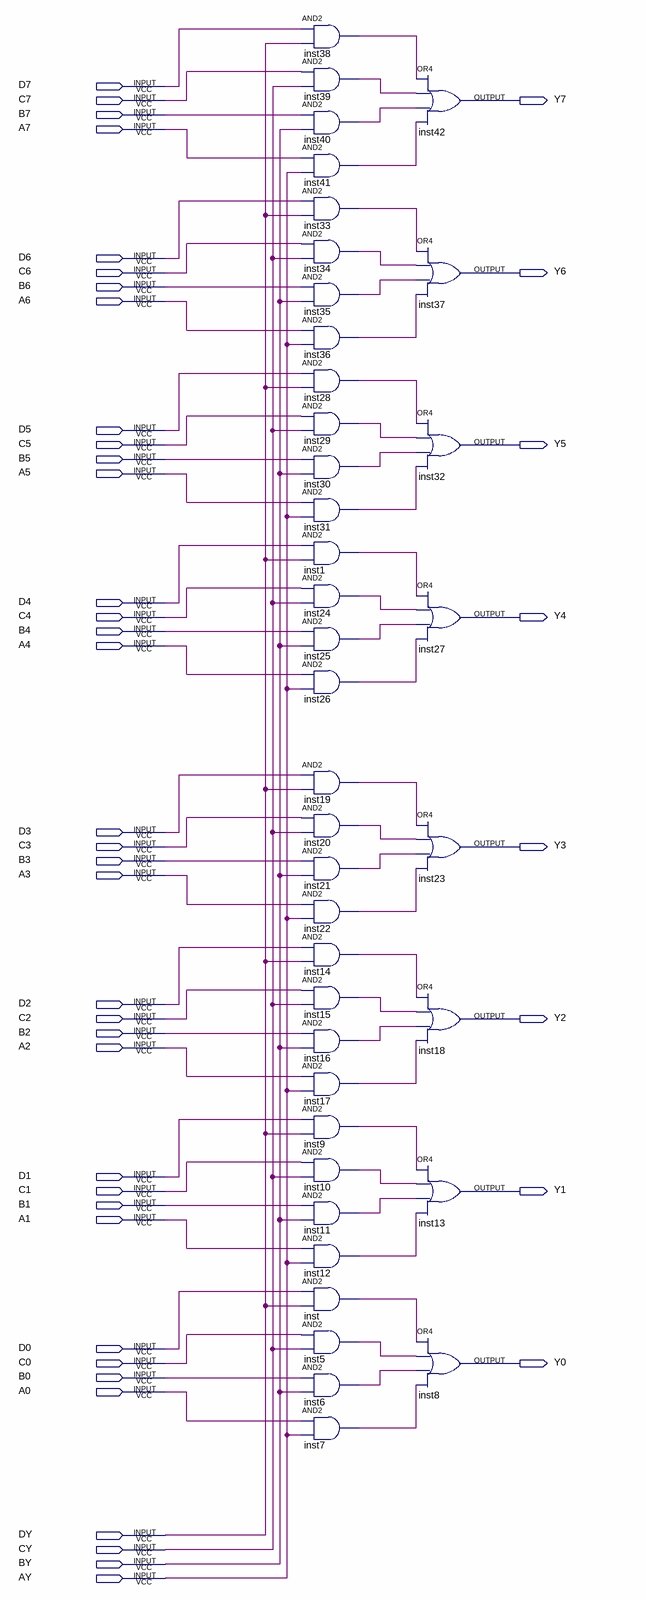
[diagram p0: schematic sheet]
// Quartus schematic multiplexer4_1.bdf as structural Verilog: 40 symbols, 44 pins
module multiplexer4_1 (
  input  D7,
  input  C7,
  input  B7,
  input  A7,
  input  D6,
  input  C6,
  input  B6,
  input  A6,
  input  D5,
  input  C5,
  input  B5,
  input  A5,
  input  D4,
  input  C4,
  input  B4,
  input  A4,
  input  D3,
  input  C3,
  input  B3,
  input  A3,
  input  D2,
  input  C2,
  input  B2,
  input  A2,
  input  D1,
  input  C1,
  input  B1,
  input  A1,
  input  D0,
  input  C0,
  input  B0,
  input  A0,
  input  DY,
  input  CY,
  input  BY,
  input  AY,
  output Y7,
  output Y6,
  output Y5,
  output Y4,
  output Y3,
  output Y2,
  output Y1,
  output Y0
);

  wire inst1_out, inst5_out, inst6_out, inst7_out, inst9_out, inst10_out, inst11_out, inst12_out, inst14_out,
       inst15_out, inst16_out, inst17_out, inst19_out, inst20_out, inst21_out, inst22_out, inst24_out,
       inst25_out, inst26_out, inst28_out, inst29_out, inst30_out, inst31_out, inst33_out, inst34_out,
       inst35_out, inst36_out, inst38_out, inst39_out, inst40_out, inst41_out, inst_out;

  and inst38 (inst38_out, D7, DY);
  and inst39 (inst39_out, C7, CY);
  and inst40 (inst40_out, B7, BY);
  and inst41 (inst41_out, A7, AY);
  and inst33 (inst33_out, D6, DY);
  and inst34 (inst34_out, C6, CY);
  and inst35 (inst35_out, B6, BY);
  and inst36 (inst36_out, A6, AY);
  and inst28 (inst28_out, D5, DY);
  and inst29 (inst29_out, C5, CY);
  and inst30 (inst30_out, B5, BY);
  and inst31 (inst31_out, A5, AY);
  and inst1 (inst1_out, D4, DY);
  and inst24 (inst24_out, C4, CY);
  and inst25 (inst25_out, B4, BY);
  and inst26 (inst26_out, A4, AY);
  and inst19 (inst19_out, D3, DY);
  and inst20 (inst20_out, C3, CY);
  and inst21 (inst21_out, B3, BY);
  and inst22 (inst22_out, A3, AY);
  and inst14 (inst14_out, D2, DY);
  and inst15 (inst15_out, C2, CY);
  and inst16 (inst16_out, B2, BY);
  and inst17 (inst17_out, A2, AY);
  and inst9 (inst9_out, D1, DY);
  and inst10 (inst10_out, C1, CY);
  and inst11 (inst11_out, B1, BY);
  and inst12 (inst12_out, A1, AY);
  and inst (inst_out, D0, DY);
  and inst5 (inst5_out, C0, CY);
  and inst6 (inst6_out, B0, BY);
  and inst7 (inst7_out, A0, AY);
  or inst42 (Y7, inst38_out, inst39_out, inst40_out, inst41_out);
  or inst37 (Y6, inst33_out, inst34_out, inst35_out, inst36_out);
  or inst32 (Y5, inst28_out, inst29_out, inst30_out, inst31_out);
  or inst27 (Y4, inst1_out, inst24_out, inst25_out, inst26_out);
  or inst23 (Y3, inst19_out, inst20_out, inst21_out, inst22_out);
  or inst18 (Y2, inst14_out, inst15_out, inst16_out, inst17_out);
  or inst13 (Y1, inst9_out, inst10_out, inst11_out, inst12_out);
  or inst8 (Y0, inst_out, inst5_out, inst6_out, inst7_out);
endmodule
